# Altium schematic sheet LevelShift_GPIOs.SchDoc
size A3; SheetNumber: 9; SheetTotal: 9
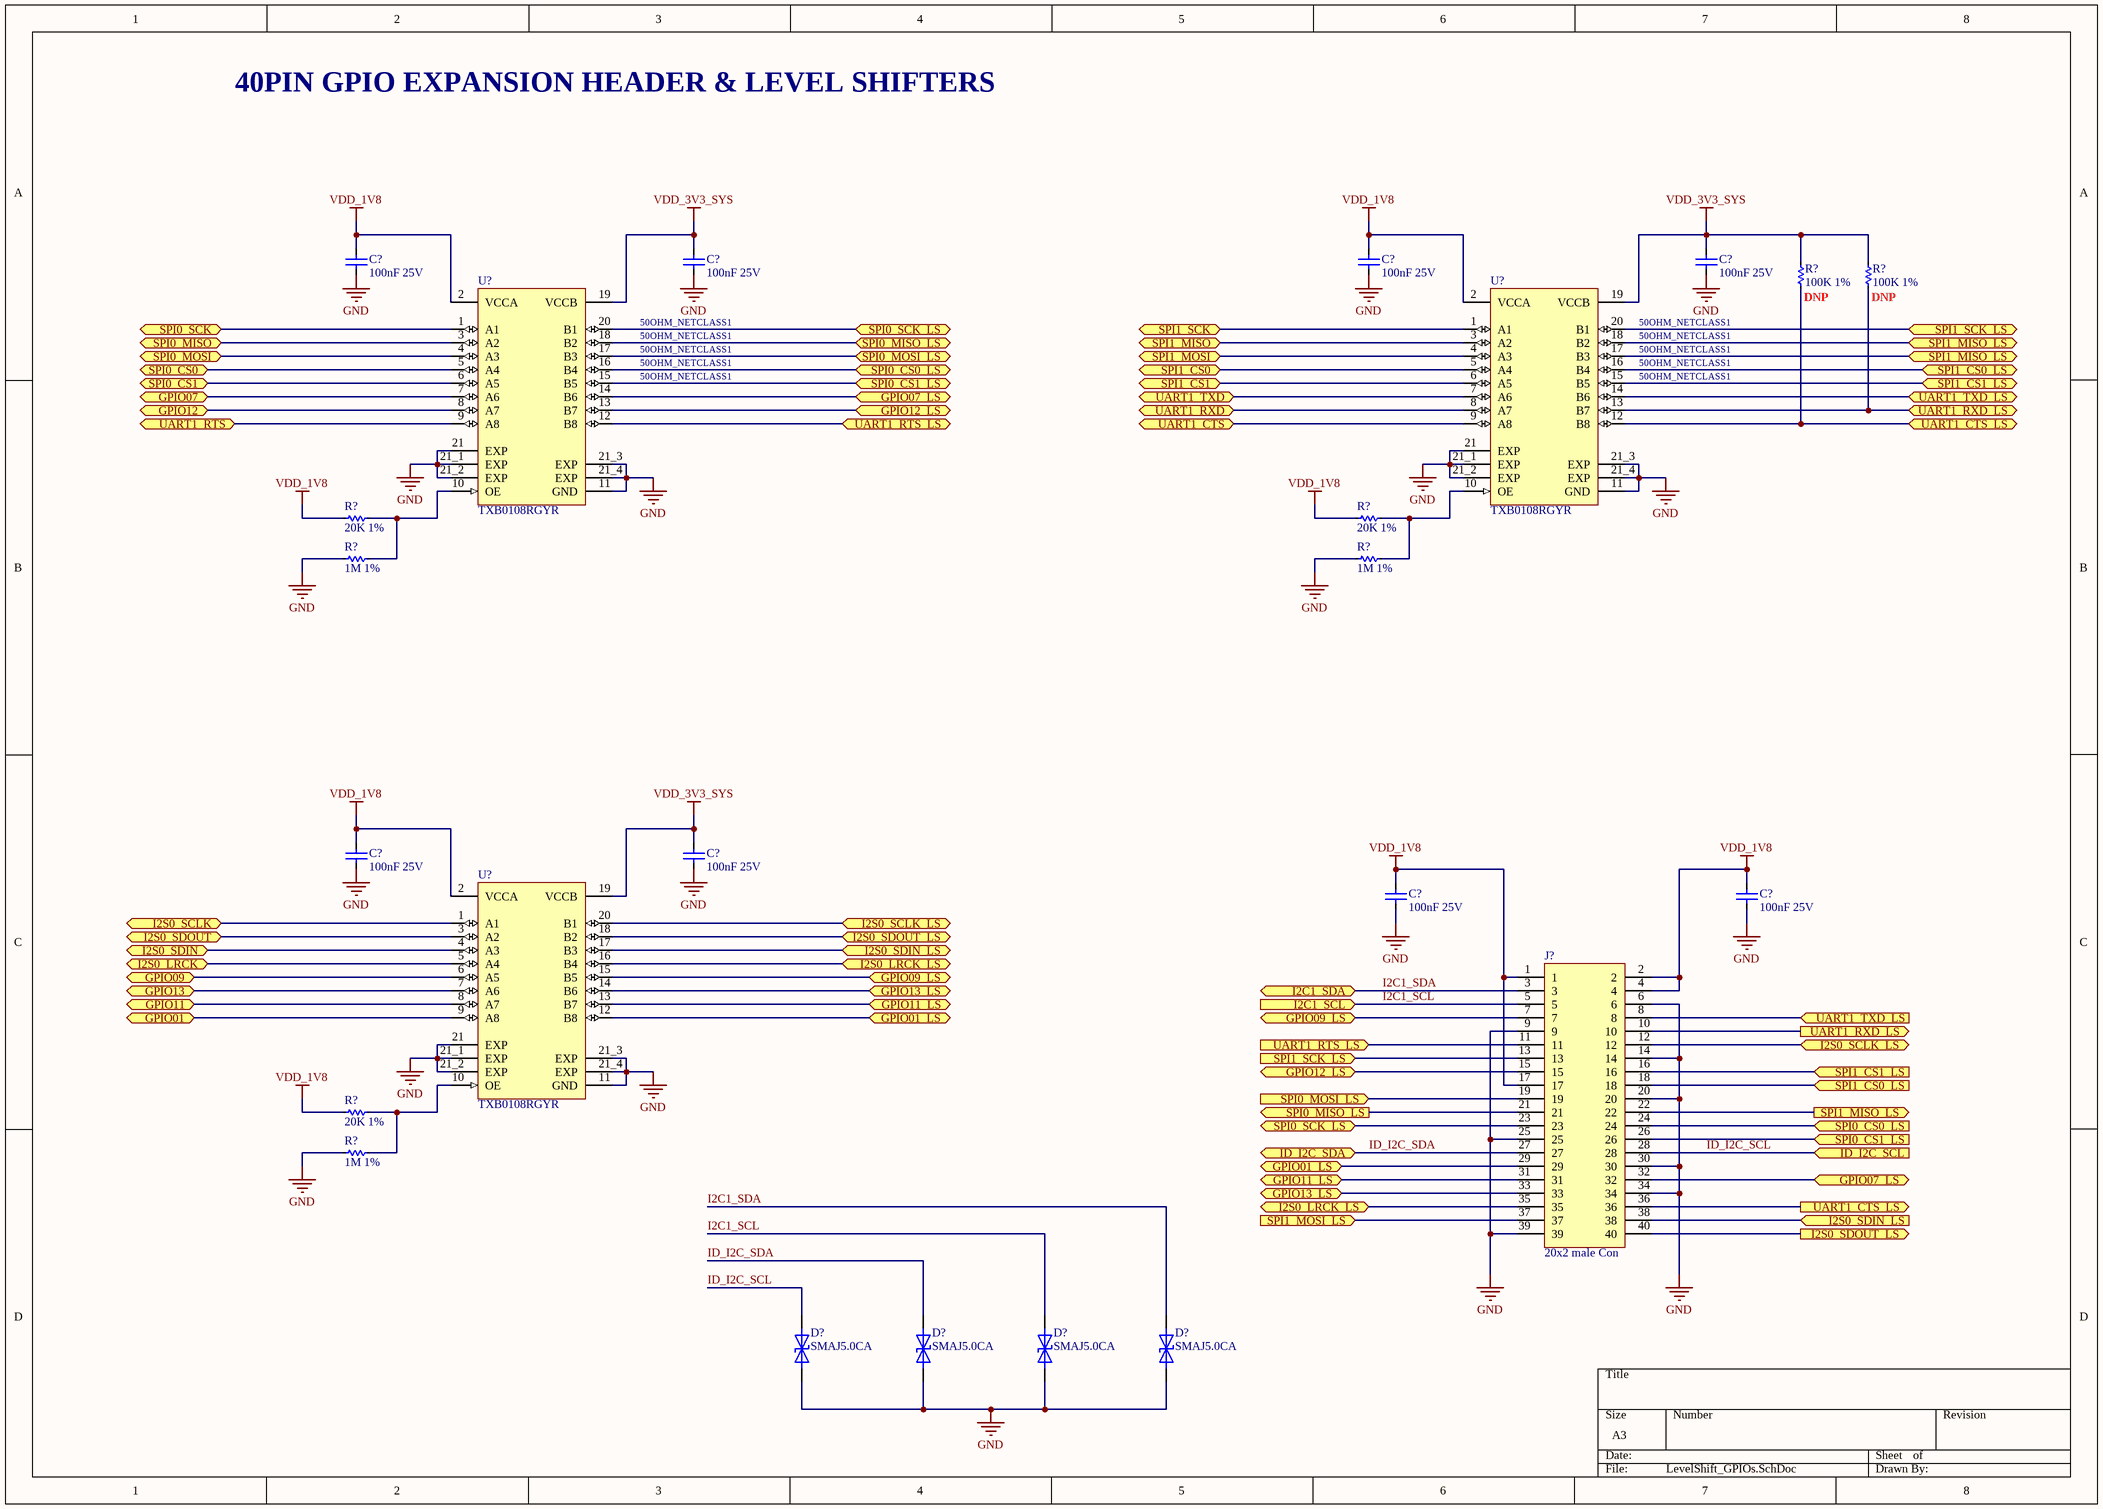
[diagram p0: LevelShift_GPIOs.SchDoc]

## Parts
(Parts that share a designator on the sheet are numbered #1, #2 ... from top to bottom, then left to right.)
C?#1  100nF 25V  [C0402]
C?#2  100nF 25V  [C0402]
C?#3  100nF 25V  [C0402]
C?#4  100nF 25V  [C0402]
C?#5  100nF 25V  [C0402]
C?#6  100nF 25V  [C0402]
C?#7  100nF 25V  [C0402]
C?#8  100nF 25V  [C0402]
D?#1  SMAJ5.0CA  [DO-214AC]
D?#2  SMAJ5.0CA  [DO-214AC]
D?#3  SMAJ5.0CA  [DO-214AC]
D?#4  SMAJ5.0CA  [DO-214AC]
J?  20x2 male Con  [70246-4001]
R?#1  100K 1%  [R0402]
R?#2  100K 1%  [R0402]
R?#3  20K 1%  [R0402]
R?#4  20K 1%  [R0402]
R?#5  1M 1%  [R0402]
R?#6  1M 1%  [R0402]
R?#7  20K 1%  [R0402]
R?#8  1M 1%  [R0402]
U?#1  TXB0108RGYR  [VQFN-20]
U?#2  TXB0108RGYR  [VQFN-20]
U?#3  TXB0108RGYR  [VQFN-20]

## Ports
GPIO01 (bidir), GPIO01_LS (bidir), GPIO07 (bidir), GPIO07_LS (bidir), GPIO09 (bidir), GPIO09_LS (bidir), GPIO11 (bidir), GPIO11_LS (bidir), GPIO12 (bidir), GPIO12_LS (bidir), GPIO13 (bidir), GPIO13_LS (bidir), I2C1_SCL (in), I2C1_SDA (bidir), I2S0_LRCK (bidir), I2S0_LRCK_LS (bidir), I2S0_SCLK (bidir), I2S0_SCLK_LS (bidir), I2S0_SDIN (bidir), I2S0_SDIN_LS (bidir), I2S0_SDIN_LS (in), I2S0_SDOUT (bidir), I2S0_SDOUT_LS (bidir), I2S0_SDOUT_LS (out), ID_I2C_SCL (in), ID_I2C_SDA (bidir), SPI0_CS0 (bidir), SPI0_CS0_LS (bidir), SPI0_CS0_LS (in), SPI0_CS1 (bidir), SPI0_CS1_LS (bidir), SPI0_CS1_LS (in), SPI0_MISO (bidir), SPI0_MISO_LS (bidir), SPI0_MISO_LS (out), SPI0_MOSI (bidir), SPI0_MOSI_LS (bidir), SPI0_MOSI_LS (in), SPI0_SCK (bidir), SPI0_SCK_LS (bidir), SPI1_CS0 (bidir), SPI1_CS0_LS (bidir), SPI1_CS0_LS (in), SPI1_CS1 (bidir), SPI1_CS1_LS (bidir), SPI1_CS1_LS (in), SPI1_MISO (bidir), SPI1_MISO_LS (bidir), SPI1_MISO_LS (out), SPI1_MOSI (bidir), SPI1_MOSI_LS (in), SPI1_SCK (bidir), SPI1_SCK_LS (bidir), SPI1_SCK_LS (in), UART1_CTS (bidir), UART1_CTS_LS (bidir), UART1_CTS_LS (out), UART1_RTS (bidir), UART1_RTS_LS (bidir), UART1_RTS_LS (in), UART1_RXD (bidir), UART1_RXD_LS (bidir), UART1_RXD_LS (out), UART1_TXD (bidir), UART1_TXD_LS (bidir), UART1_TXD_LS (in)

## Nets
GND: C?#1.1 C?#2.1 C?#3.1 C?#4.1 C?#5.1 C?#6.1 C?#7.1 C?#8.1 D?#1.C D?#2.C D?#3.C D?#4.C J?.6 J?.9 J?.14 J?.20 J?.25 J?.30 J?.34 J?.39 R?#5.1 R?#6.1 R?#8.1 U?#1.11(GND) U?#1.21(EXP) U?#1.21_1(EXP) U?#1.21_2(EXP) U?#1.21_3(EXP) U?#1.21_4(EXP) U?#2.11(GND) U?#2.21(EXP) U?#2.21_1(EXP) U?#2.21_2(EXP) U?#2.21_3(EXP) U?#2.21_4(EXP) U?#3.11(GND) U?#3.21(EXP) U?#3.21_1(EXP) U?#3.21_2(EXP) U?#3.21_3(EXP) U?#3.21_4(EXP)
VDD_1V8: C?#1.2 C?#3.2 C?#5.2 C?#7.2 C?#8.2 J?.1 J?.2 J?.4 J?.17 R?#3.1 R?#4.1 R?#7.1 U?#1.2(VCCA) U?#2.2(VCCA) U?#3.2(VCCA)
VDD_3V3_SYS: C?#2.2 C?#4.2 C?#6.2 R?#1.2 R?#2.2 U?#1.19(VCCB) U?#2.19(VCCB) U?#3.19(VCCB)
GPIO01: U?#3.9(A8) ; port GPIO01
GPIO01_LS: J?.29 U?#3.12(B8) ; port GPIO01_LS
GPIO07: U?#1.7(A6) ; port GPIO07
GPIO07_LS: J?.32 U?#1.14(B6) ; port GPIO07_LS
GPIO09: U?#3.6(A5) ; port GPIO09
GPIO09_LS: J?.7 U?#3.15(B5) ; port GPIO09_LS
GPIO11: U?#3.8(A7) ; port GPIO11
GPIO11_LS: J?.31 U?#3.13(B7) ; port GPIO11_LS
GPIO12: U?#1.8(A7) ; port GPIO12
GPIO12_LS: J?.15 U?#1.13(B7) ; port GPIO12_LS
GPIO13: U?#3.7(A6) ; port GPIO13
GPIO13_LS: J?.33 U?#3.14(B6) ; port GPIO13_LS
I2C1_SCL: D?#3.A J?.5 ; port I2C1_SCL
I2C1_SDA: D?#4.A J?.3 ; port I2C1_SDA
I2S0_LRCK: U?#3.5(A4) ; port I2S0_LRCK
I2S0_LRCK_LS: J?.35 U?#3.16(B4) ; port I2S0_LRCK_LS
I2S0_SCLK: U?#3.1(A1) ; port I2S0_SCLK
I2S0_SCLK_LS: J?.12 U?#3.20(B1) ; port I2S0_SCLK_LS
I2S0_SDIN: U?#3.4(A3) ; port I2S0_SDIN
I2S0_SDIN_LS: J?.38 U?#3.17(B3) ; port I2S0_SDIN_LS
I2S0_SDOUT: U?#3.3(A2) ; port I2S0_SDOUT
I2S0_SDOUT_LS: J?.40 U?#3.18(B2) ; port I2S0_SDOUT_LS
ID_I2C_SCL: D?#1.A J?.28 ; port ID_I2C_SCL
ID_I2C_SDA: D?#2.A J?.27 ; port ID_I2C_SDA
SPI0_CS0: U?#1.5(A4) ; port SPI0_CS0
SPI0_CS0_LS: J?.24 U?#1.16(B4) ; port SPI0_CS0_LS
SPI0_CS1: U?#1.6(A5) ; port SPI0_CS1
SPI0_CS1_LS: J?.26 U?#1.15(B5) ; port SPI0_CS1_LS
SPI0_MISO: U?#1.3(A2) ; port SPI0_MISO
SPI0_MISO_LS: J?.21 U?#1.18(B2) ; port SPI0_MISO_LS
SPI0_MOSI: U?#1.4(A3) ; port SPI0_MOSI
SPI0_MOSI_LS: J?.19 U?#1.17(B3) ; port SPI0_MOSI_LS
SPI0_SCK: U?#1.1(A1) ; port SPI0_SCK
SPI0_SCK_LS: J?.23 U?#1.20(B1) ; port SPI0_SCK_LS
SPI1_CS0: U?#2.5(A4) ; port SPI1_CS0
SPI1_CS0_LS: J?.18 U?#2.16(B4) ; port SPI1_CS0_LS
SPI1_CS1: U?#2.6(A5) ; port SPI1_CS1
SPI1_CS1_LS: J?.16 U?#2.15(B5) ; port SPI1_CS1_LS
SPI1_MISO: U?#2.3(A2) ; port SPI1_MISO
SPI1_MISO_LS: J?.22 U?#2.17(B3) U?#2.18(B2) ; port SPI1_MISO_LS
SPI1_MOSI: U?#2.4(A3) ; port SPI1_MOSI
SPI1_MOSI_LS: J?.37 ; port SPI1_MOSI_LS
SPI1_SCK: U?#2.1(A1) ; port SPI1_SCK
SPI1_SCK_LS: J?.13 U?#2.20(B1) ; port SPI1_SCK_LS
UART1_CTS: U?#2.9(A8) ; port UART1_CTS
UART1_CTS_LS: J?.36 R?#1.1 U?#2.12(B8) ; port UART1_CTS_LS
UART1_RTS: U?#1.9(A8) ; port UART1_RTS
UART1_RTS_LS: J?.11 U?#1.12(B8) ; port UART1_RTS_LS
UART1_RXD: U?#2.8(A7) ; port UART1_RXD
UART1_RXD_LS: J?.10 R?#2.1 U?#2.13(B7) ; port UART1_RXD_LS
UART1_TXD: U?#2.7(A6) ; port UART1_TXD
UART1_TXD_LS: J?.8 U?#2.14(B6) ; port UART1_TXD_LS
NetR?#3_2: R?#3.2 R?#5.2 U?#1.10(OE)
NetR?#4_2: R?#4.2 R?#6.2 U?#2.10(OE)
NetR?#7_2: R?#7.2 R?#8.2 U?#3.10(OE)

## Notes on the sheet
- 40PIN GPIO EXPANSION HEADER & LEVEL SHIFTERS
- (near R?#1) DNP
- (near R?#2) DNP
- 50OHM_NETCLASS1
- (near U?#2) 50OHM_NETCLASS1

## Library data of the parts
C?#1-C?#8 = TMK105BJ104KV-F: CAP CER 0.1UF 25V X5R 0402 / High Value Multilayer Ceramic Capacitors (High dielectric type); Manufacturer: Taiyo Yuden; Tolerance: 10%; Supplier 1: Digi-Key; Manufacturer Part Number: TMK105BJ104KV-F; RoHS: Yes; Category: Ceramic Capacitors; Stock 1: 11997960; Pricing 1: 1=0.10000, 10=0.03700, 50=0.02000, 100=0.01630, 500=0.01166, 1000=0.00917, 2500=0.00833, 5000=0.00767 (USD); Mount: Surface Mount; Case/Package: 0402; Number of Pins: 2; Case Code (Imperial): 0402; Case Code (Metric): 1005; Weight: 2.3E-05oz; Min Operating Temperature: -55°C; Max Operating Temperature: 85°C; Capacitance: 100nF; Packaging: Tape and Reel; Dielectric: X5R; Voltage Rating (DC): 25V; Voltage Rating: 25V; Package Quantity: 1; Termination: SMD/SMT; Resistor Type: Ceramic; Voltage: 25V; Series: M; Construction: Flat; Length: 1mm; Width: 0.02inch; Height: 0.5mm; Depth: 0.5mm; Thickness: 0.022inch; Reach SVHC Compliant: Yes; Lead Free: Lead Free; Halogen Free: Halogen Free; RoHS Compliant: Yes; Supplier Part Number 1: 587-1456-1-ND
D?#1-D?#4 = SMAJ5.0CA: Transient Voltage Suppressor, TVS, SMAJ Series, Bidirectional, 5 V, DO-214AC, 2, 6.4 V RoHS Compliant: Yes; Manufacturer: Littelfuse; Reverse Breakdown Voltage: 6.4V; Operating Supply Voltage: 5V; Max Surge Current: 43.5A; Number of Elements: 1; Clamping Voltage: 9.2V; Peak Pulse Power: 400W; Power Line Protection: No; Test Current: 10mA; Max Reverse Leakage Current: 800uA; Max Breakdown Voltage: 7V; Max Power Dissipation: 3.3W; Element Configuration: Single; Leakage Current: 1.6mA; Capacitance: 1.05nF; Diode Type: ZENER; Supplier 1: Digi-Key; Manufacturer Part Number: SMAJ5.0CA; RoHS: Yes; Category: TVS Diodes; Stock 1: 526420; Pricing 1: 1=0.43000, 10=0.32000, 100=0.19950, 500=0.13650, 1000=0.10500, 2000=0.09450 (USD); Mount: Surface Mount; Case/Package: DO-214AC; Number of Pins: 2; Min Operating Temperature: -65°C; Max Operating Temperature: 150°C; Package Quantity: 5000; Direction: Bidirectional; Packaging: Tape and Reel; Number of Bidirectional Channels: 1; Reverse Standoff Voltage: 5V; Min Breakdown Voltage: 6.4V; Breakdown Voltage: 6.4V; Number of Channels: 1; Polarity: Bidirectional; Termination: SMD/SMT; Peak Pulse Current: 43.5A; Power Dissipation: 400W; Voltage Rating (DC): 5V; Max Output Current: 43.5A; Resistor Type: Zener; Series: SMAJ; Clamping Voltage-Max: 9.2V; Length: 4.5mm; Width: 2.79mm; Height: 2.087mm; Radiation Hardening: No; Reach SVHC Compliant: Yes; Lead Free: Lead Free; RoHS Compliant: Yes; ComponentLink1URL: https://datasheet.ciiva.com/25624/0900766b810f4edb-25624837.pdf?src-supplier=Rs; ComponentLink1Description: https://datasheet.ciiva.com/25624/0900766b810f4edb-25624837.pdf?src-supplier=Rs; ComponentLink2URL: https://datasheet.ciiva.com/28473/607617-28473438.pdf?src-supplier=Element14; ComponentLink2Description: https://datasheet.ciiva.com/28473/607617-28473438.pdf?src-supplier=Element14; ComponentLink3URL: https://datasheet.ciiva.com/16206/littelfuse-tvs-diode-smaj-16206104.pdf?src-supplier=Future+Electronics; ComponentLink3Description: https://datasheet.ciiva.com/16206/littelfuse-tvs-diode-smaj-16206104.pdf?src-supplier=Future+Electronics; ComponentLink4URL: https://datasheet.ciiva.com/331/littelfuse-tvs-diode-smaj-datasheet-pdf-331055.pdf?src-supplier=Digi-Key; ComponentLink4Description: https://datasheet.ciiva.com/331/littelfuse-tvs-diode-smaj-datasheet-pdf-331055.pdf?src-supplier=Digi-Key; ComponentLink5URL: https://datasheet.ciiva.com/331/littelfuse-tvs-diode-smaj-datasheet-pdf-331056.pdf?src-supplier=Digi-Key; ComponentLink5Description: https://datasheet.ciiva.com/331/littelfuse-tvs-diode-smaj-datasheet-pdf-331056.pdf?src-supplier=Digi-Key; ComponentLink6URL: https://datasheet.ciiva.com/331/littelfuse-tvs-diode-smaj-datasheet-pdf-331054.pdf?src-supplier=Digi-Key; ComponentLink6Description: https://datasheet.ciiva.com/331/littelfuse-tvs-diode-smaj-datasheet-pdf-331054.pdf?src-supplier=Digi-Key; Supplier Part Number 1: SMAJ5.0CALFCT-ND
J? = 0702464001: Conn Shrouded Header (4 Sides) HDR 40 POS 2.54mm Solder ST Thru-Hole C-Grid® Frame; Manufacturer: Molex; Supplier 1: Digi-Key; Manufacturer Part Number: 0702464001; RoHS: Yes; Category: Uncategorized; Stock 1: 9741; Pricing 1: 1=4.29000, 10=3.77400, 400=3.00210, 1200=2.48745 (USD); ComponentLink1URL: https://datasheet.ciiva.com/6814/702461001-sd-6814000.pdf?src-supplier=Digi-Key; ComponentLink1Description: Datasheet; Supplier Part Number 1: WM6550-ND
R?#1 R?#2 = RC0402FR-07100KL: RES SMD 100K OHM 1% 1/16W 0402; Manufacturer: Yageo; Power Rating: 63mW; Voltage Rating: 50V; Resistance: 100kR; Temperature Coefficient: 100ppm/°C; Supplier 1: Digi-Key; Manufacturer Part Number: RC0402FR-07100KL; RoHS: Yes; Category: Chip SMD Resistors; Stock 1: 41082272; Pricing 1: 1=0.10000, 10=0.01400, 100=0.00580, 1000=0.00262, 2500=0.00228, 5000=0.00188 (USD); Case/Package: 0402; Case Code (Metric): 1005; Case Code (Imperial): 0402; Min Operating Temperature: -55°C; Max Operating Temperature: 155°C; Tolerance: 1%; Package Quantity: 1; Packaging: Tape and Reel; Resistor Type: Thick Film; Number of Terminations: 2; Termination: SMD/SMT; Max Power Dissipation: 63mW; Working Voltage: 50V; Features: Moisture Resistant; Series: RC; Resistance Tolerance: 1%; Construction: Rectangular; Technology: THICK FILM; Length: 0.039inch; Width: 0.02inch; Height: 0.016inch; Depth: 0.5mm; Reach SVHC Compliant: Yes; Military Standard: Not; Lead Free: Lead Free; RoHS Compliant: Yes; ComponentLink1URL: https://datasheet.ciiva.com/11819/0900766b80c66297-11819452.pdf?src-supplier=RSComponents; ComponentLink1Description: https://datasheet.ciiva.com/11819/0900766b80c66297-11819452.pdf?src-supplier=RSComponents; ComponentLink2URL: https://datasheet.ciiva.com/22747/1018594-22747509.pdf?src-supplier=Element14; ComponentLink2Description: https://datasheet.ciiva.com/22747/1018594-22747509.pdf?src-supplier=Element14; ComponentLink3URL: https://datasheet.ciiva.com/2453/pyu-r-int-thick-7-2453362.pdf?src-supplier=Digi-Key; ComponentLink3Description: https://datasheet.ciiva.com/2453/pyu-r-int-thick-7-2453362.pdf?src-supplier=Digi-Key; ComponentLink4URL: https://datasheet.ciiva.com/2453/pyu-r-int-thick-7-2453363.pdf?src-supplier=Digi-Key; ComponentLink4Description: https://datasheet.ciiva.com/2453/pyu-r-int-thick-7-2453363.pdf?src-supplier=Digi-Key; ComponentLink5URL: https://datasheet.ciiva.com/2453/pyu-r-int-thick-7-2453361.pdf?src-supplier=Digi-Key; ComponentLink5Description: https://datasheet.ciiva.com/2453/pyu-r-int-thick-7-2453361.pdf?src-supplier=Digi-Key; ComponentLink6URL: https://datasheet.ciiva.com/12667/pyu-rc0402-51-rohs-l-6-r-12667930.pdf?src-supplier=Mouser; ComponentLink6Description: https://datasheet.ciiva.com/12667/pyu-rc0402-51-rohs-l-6-r-12667930.pdf?src-supplier=Mouser; ComponentLink7URL: https://datasheet.ciiva.com/15189/getdatasheetpartid-323696-15189334.pdf?src-supplier=Verical; ComponentLink7Description: https://datasheet.ciiva.com/15189/getdatasheetpartid-323696-15189334.pdf?src-supplier=Verical; Supplier Part Number 1: 311-100KLRCT-ND
R?#3 R?#4 R?#7 = AC0402FR-0720KL: Res Thick Film 0402 20K Ohm 1% 0.063W(1/16W) ±100ppm/C Pad SMD Automotive T/R; Manufacturer: Yageo; Power Rating: 62.5mW; Resistance: 20kR; Voltage Rating: 50V; Max Power Dissipation: 63mW; Temperature Coefficient: 100ppm/°C; Supplier 1: Digi-Key; Manufacturer Part Number: AC0402FR-0720KL; RoHS: Yes; Category: Chip SMD Resistors; Stock 1: 682198; Pricing 1: 1=0.10000, 10=0.01900, 100=0.00790, 1000=0.00353, 2500=0.00307, 5000=0.00253 (USD); Case/Package: 0402; Case Code (Imperial): 0402; Case Code (Metric): 1005; Min Operating Temperature: -55°C; Max Operating Temperature: 155°C; Packaging: Tape and Reel; Tolerance: 1%; Resistor Type: Thick Film; Number of Terminations: 2; Termination: SMD/SMT; Features: Moisture Resistant,Automotive AEC-Q200; Series: AC; Length: 0.039inch; Width: 0.02inch; Height: 0.015inch; RoHS Compliant: Yes; ComponentLink1URL: http://www.mouser.com/ds/2/447/yageodocoutput-1111992.pdf?src-supplier=Mouser; ComponentLink1Description: http://www.mouser.com/ds/2/447/yageodocoutput-1111992.pdf?src-supplier=Mouser; ComponentLink2URL: http://www.yageo.com/NewPortal/yageodocoutput?fileName=/pdf/R-Chip/PYu-AC_51_RoHS_L_6.pdf&src-supplier=Digi-Key; ComponentLink2Description: http://www.yageo.com/NewPortal/yageodocoutput?fileName=/pdf/R-Chip/PYu-AC_51_RoHS_L_6.pdf&src-supplier=Digi-Key; Supplier Part Number 1: YAG3454CT-ND
R?#5 R?#6 R?#8 = AC0402FR-071ML: RES SMD 1M OHM 1% 1/16W 0402; Manufacturer: Yageo; Power Rating: 62.5mW; Resistance: 1MR; Voltage Rating: 50V; Temperature Coefficient: 100ppm/°C; Max Power Dissipation: 63mW; Supplier 1: Digi-Key; Manufacturer Part Number: AC0402FR-071ML; RoHS: Yes; Category: Chip SMD Resistors; Stock 1: 684587; Pricing 1: 1=0.10000, 10=0.01900, 100=0.00790, 1000=0.00353, 2500=0.00307, 5000=0.00253 (USD); Case/Package: 0402; Case Code (Imperial): 0402; Case Code (Metric): 1005; Size Code: 0402; Min Operating Temperature: -55°C; Max Operating Temperature: 155°C; Packaging: Tape and Reel; Tolerance: 1%; Termination: SMD/SMT; Resistor Type: Thick Film; Number of Terminations: 2; Features: Moisture Resistant,Automotive AEC-Q200; Series: AC; Construction: Rectangular; Length: 1mm; Width: 0.5mm; Height: 0.015inch; Depth: 0.5mm; Military Standard: Not; Lead Free: Lead Free; RoHS Compliant: Yes; ComponentLink1URL: http://www.yageo.com/documents/recent/PYu-AC_51_RoHS_L_2.pdf?src-supplier=Mouser; ComponentLink1Description: http://www.yageo.com/documents/recent/PYu-AC_51_RoHS_L_2.pdf?src-supplier=Mouser; ComponentLink2URL: http://www.yageo.com/documents/recent/PYu-AC_51_RoHS_L_2_revised.pdf?src-supplier=Future+Electronics; ComponentLink2Description: http://www.yageo.com/documents/recent/PYu-AC_51_RoHS_L_2_revised.pdf?src-supplier=Future+Electronics; ComponentLink3URL: http://www.yageo.com/NewPortal/yageodocoutput?fileName=/pdf/R-Chip/PYu-AC_51_RoHS_L_6.pdf&src-supplier=Digi-Key; ComponentLink3Description: http://www.yageo.com/NewPortal/yageodocoutput?fileName=/pdf/R-Chip/PYu-AC_51_RoHS_L_6.pdf&src-supplier=Digi-Key; Supplier Part Number 1: YAG3450CT-ND
U?#1-U?#3 = TXB0108RGYR: IC 8-BIT TRNSLTR 15KV ESD 20VQFN; Manufacturer: Texas Instruments; Data Rate: 100Mbps; Number of Channels: 8; Propagation Delay: 9.5ns; Max Supply Voltage: 5.5V; Min Supply Voltage: 1.2V; Logic Function: Translator; Turn-On Delay Time: 35.6ns; Low Level Output Current: 20uA; High Level Output Current: -20uA; Quiescent Current: 3.5uA; Output Type: 3-STATE; Rise Time: 0.8ns; Nominal Supply Current: 10uA; Channel Type: Bidirectional; Number of Circuits: 1; Supplier 1: Mouser; Manufacturer Part Number: TXB0108RGYR; RoHS: Yes; Category: Voltage Level Shifters; Stock 1: 23719; Pricing 1: 1=1.63000, 10=1.46000, 50=1.38000, 100=1.18000, 1000=0.80200, 10000=0.80100 (USD); Mount: Surface Mount; Case/Package: VQFN EP; Number of Pins: 20; Weight: 0.001517oz; Contact Plating: Gold; Min Operating Temperature: -40°C; Max Operating Temperature: 85°C; Package Quantity: 3000; Packaging: Tape and Reel; Number of Bits: 8; Output Current: 20uA; Series: -; Number of Inputs: 8; Termination: SMD/SMT; Supply Current: 10uA; Length: 4.5mm; Width: 3.5mm; Height: 0.8mm; Radiation Hardening: No; Lead Free: Lead Free; RoHS Compliant: Yes; Reach SVHC Compliant: Yes; ComponentLink1URL: https://datasheet.ciiva.com/15096/getdatasheetpartid-172984-15096214.pdf?src-supplier=Verical; ComponentLink1Description: https://datasheet.ciiva.com/15096/getdatasheetpartid-172984-15096214.pdf?src-supplier=Verical; ComponentLink2URL: https://datasheet.ciiva.com/1508/1811182-1508728.pdf?src-supplier=Element14; ComponentLink2Description: https://datasheet.ciiva.com/1508/1811182-1508728.pdf?src-supplier=Element14; ComponentLink3URL: https://datasheet.ciiva.com/1899/txb0108-1899602.pdf?src-supplier=Digi-Key; ComponentLink3Description: https://datasheet.ciiva.com/1899/txb0108-1899602.pdf?src-supplier=Digi-Key; ComponentLink4URL: https://datasheet.ciiva.com/1899/txb0108-1899601.pdf?src-supplier=Digi-Key; ComponentLink4Description: https://datasheet.ciiva.com/1899/txb0108-1899601.pdf?src-supplier=Digi-Key; ComponentLink5URL: https://datasheet.ciiva.com/1899/txb0108-1899603.pdf?src-supplier=Digi-Key; ComponentLink5Description: https://datasheet.ciiva.com/1899/txb0108-1899603.pdf?src-supplier=Digi-Key; Supplier Part Number 1: 595-TXB0108RGYR